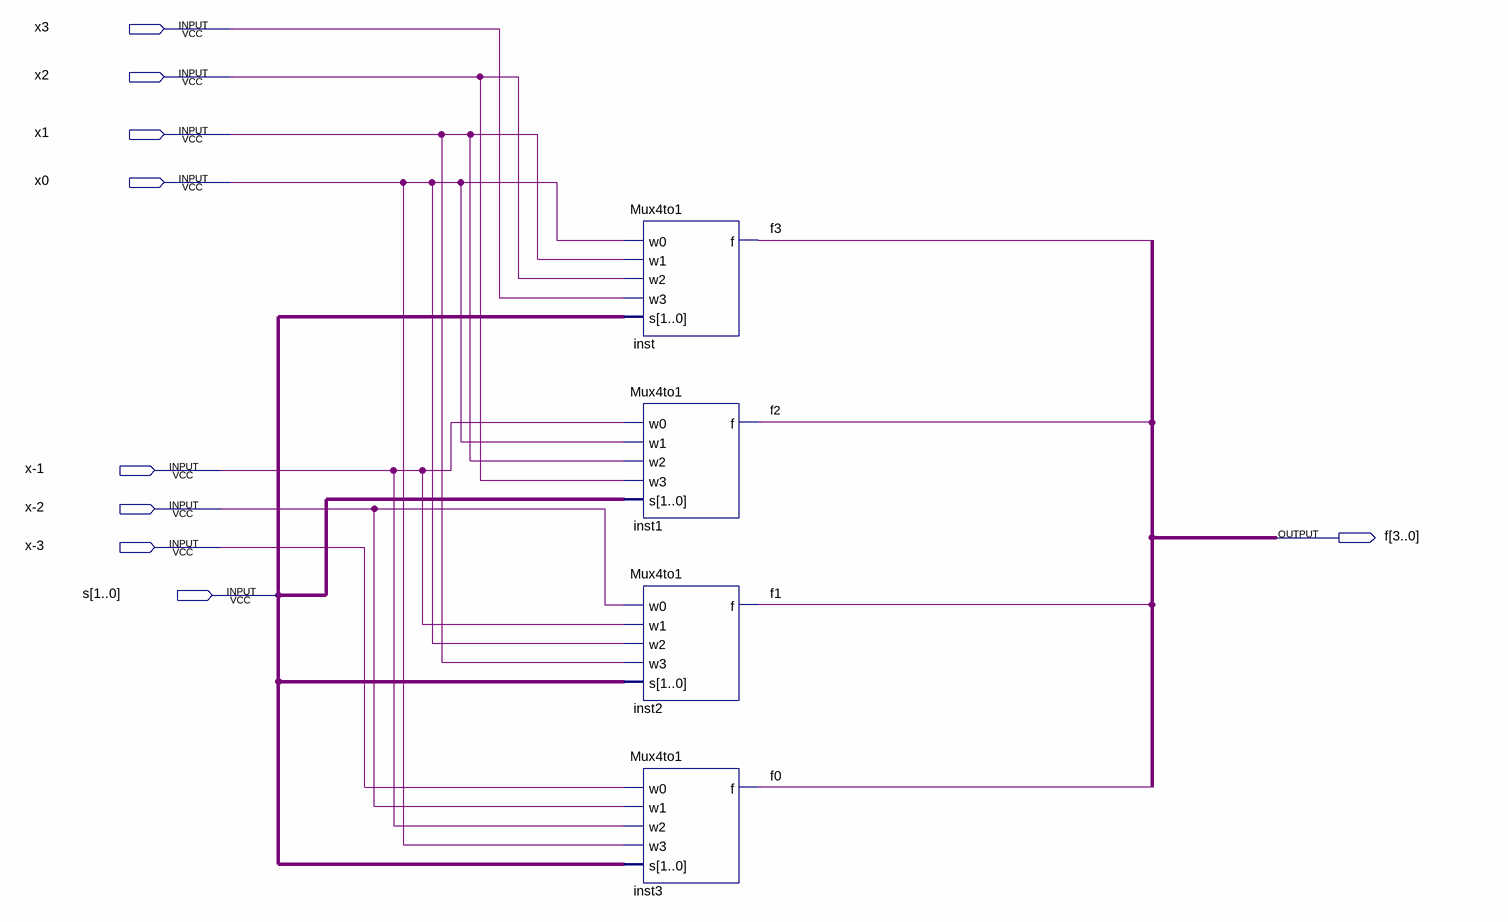
[diagram p0: schematic sheet]
// Quartus schematic Mux4step1.bdf as structural Verilog: 4 symbols, 9 pins
module Mux4step1 (
  input  x3,
  input  x2,
  input  x1,
  input  x0,
  input  \x-1 ,
  input  \x-2 ,
  input  \x-3 ,
  input  [1:0] s,
  output [3:0] f
);

  Mux4to1 inst (.w0(x0), .w1(x1), .w2(x2), .w3(x3), .s(s), .f(f[3]));
  Mux4to1 inst1 (.w0(\x-1 ), .w1(x0), .w2(x1), .w3(x2), .s(s), .f(f[2]));
  Mux4to1 inst2 (.w0(\x-2 ), .w1(\x-1 ), .w2(x0), .w3(x1), .s(s), .f(f[1]));
  Mux4to1 inst3 (.w0(\x-3 ), .w1(\x-2 ), .w2(\x-1 ), .w3(x0), .s(s), .f(f[0]));
endmodule
